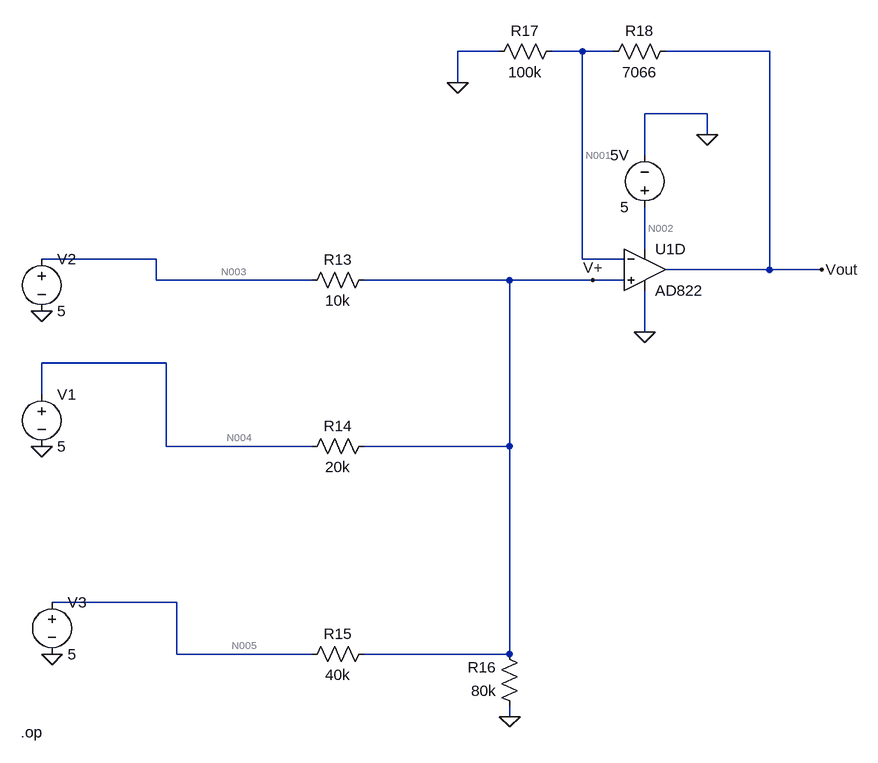
[diagram p0: schematic APP3 LTspice.asc]
APP3 LTspice.asc, the LTspice schematic file:
Version 4
SHEET 1 1444 680
WIRE 464 -464 400 -464
WIRE 592 -464 544 -464
WIRE 640 -464 592 -464
WIRE 880 -464 720 -464
WIRE 400 -416 400 -464
WIRE 784 -368 688 -368
WIRE 784 -336 784 -368
WIRE 688 -304 688 -368
WIRE 688 -160 688 -224
WIRE -64 -144 -240 -144
WIRE 592 -144 592 -464
WIRE 656 -144 592 -144
WIRE 880 -128 880 -464
WIRE 880 -128 720 -128
WIRE 960 -128 880 -128
WIRE -64 -112 -64 -144
WIRE 176 -112 -64 -112
WIRE 480 -112 256 -112
WIRE 608 -112 480 -112
WIRE 656 -112 608 -112
WIRE 688 -32 688 -96
WIRE -48 16 -240 16
WIRE -240 64 -240 16
WIRE -48 144 -48 16
WIRE 176 144 -48 144
WIRE 480 144 480 -112
WIRE 480 144 256 144
WIRE -32 384 -224 384
WIRE -32 464 -32 384
WIRE 176 464 -32 464
WIRE 480 464 480 144
WIRE 480 464 256 464
WIRE 480 560 480 544
FLAG 480 560 0
FLAG 400 -416 0
FLAG 688 -32 0
FLAG 784 -336 0
FLAG -240 -64 0
FLAG -240 144 0
FLAG -224 464 0
FLAG 960 -128 Vout
FLAG 608 -112 V+
DATAFLAG 496 -112 ""
DATAFLAG 864 -128 ""
SYMBOL res 160 -96 R270
WINDOW 0 32 56 VTop 2
WINDOW 3 0 56 VBottom 2
SYMATTR InstName R13
SYMATTR Value 10k
SYMBOL res 272 128 R90
WINDOW 0 0 56 VBottom 2
WINDOW 3 32 56 VTop 2
SYMATTR InstName R14
SYMATTR Value 20k
SYMBOL res 272 448 R90
WINDOW 0 0 56 VBottom 2
WINDOW 3 32 56 VTop 2
SYMATTR InstName R15
SYMATTR Value 40k
SYMBOL res 496 560 R180
WINDOW 0 36 76 Left 2
WINDOW 3 36 40 Left 2
SYMATTR InstName R16
SYMATTR Value 80k
SYMBOL voltage 688 -208 R180
WINDOW 0 24 96 Left 2
WINDOW 3 24 16 Left 2
SYMATTR InstName 5V
SYMATTR Value 5
SYMBOL OpAmps\\AD822 688 -192 R0
SYMATTR InstName U1D
SYMBOL res 560 -480 R90
WINDOW 0 0 56 VBottom 2
WINDOW 3 32 56 VTop 2
SYMATTR InstName R17
SYMATTR Value 100k
SYMBOL res 736 -480 R90
WINDOW 0 0 56 VBottom 2
WINDOW 3 32 56 VTop 2
SYMATTR InstName R18
SYMATTR Value 7066
SYMBOL voltage -240 48 R0
SYMATTR InstName V1
SYMATTR Value 5
SYMBOL voltage -240 -160 R0
WINDOW 123 0 0 Left 0
WINDOW 39 0 0 Left 0
SYMATTR InstName V2
SYMATTR Value 5
SYMBOL voltage -224 368 R0
WINDOW 123 0 0 Left 0
WINDOW 39 0 0 Left 0
SYMATTR InstName V3
SYMATTR Value 5
TEXT -272 584 Left 2 !.op

The netlist it stands for:
* APP3 LTspice.asc
R13 N003 V+ 10k
R14 V+ N004 20k
R15 V+ N005 40k
R16 0 V+ 80k
V§5V N002 0 5
XU1D V+ N001 N002 0 Vout AD822  ; pins In+ In- V+ V- OUT
R17 N001 0 100k
R18 Vout N001 7066
V1 N004 0 5
V2 N003 0 5
V3 N005 0 5
.op
.backanno
.end

* Results of the author's LTspice run, read from the files saved beside the schematic
* Operating Point:
*   V(n003) = 5 V
*   V(v+) = 4.667 V
*   V(n004) = 5 V
*   V(n005) = 5 V
*   V(n002) = 5 V
*   V(n001) = 4.664 V
*   V(vout) = 4.993 V
*   I(R18) = 46.64 µA
*   I(R17) = 46.64 µA
*   I(R16) = -58.33 µA
*   I(R15) = -8.333 µA
*   I(R14) = -16.67 µA
*   I(R13) = 33.33 µA
*   I(V3) = -8.333 µA
*   I(V2) = -33.33 µA
*   I(V1) = -16.67 µA
*   I(5v) = -708.9 µA
*   Ix(u1d:1) = 2.109 pA
*   Ix(u1d:2) = 2.108 pA
*   Ix(u1d:3) = 708.9 µA
*   Ix(u1d:4) = -662.3 µA
*   Ix(u1d:5) = -46.64 µA
* From the log:
*   Semiconductor Device Operating Points:
*                           --- Diodes ---
*   Name:    d:u1d:3     d:u1d:2     d:u1d:1     d:u1d:6     d:u1d:5
*   Model:  u1d:45ma    u1d:20ohm    u1d:iq      u1d:x2      u1d:x1
*   Id:     -4.66e-05    4.66e-05    6.60e-04   -2.50e-06   -2.44e-09
*   Vd:     -4.66e-04    1.24e-03    5.00e+00   -5.00e+00   -4.88e-03
*   Req:     1.00e-01    1.00e-01    5.00e-04    5.00e-07    5.00e-07
*   CAP:     0.00e+00    0.00e+00    0.00e+00    0.00e+00    0.00e+00
*   Name:   d:u1d:22    d:u1d:21
*   Model:   u1d:esd     u1d:esd
*   Id:     -2.50e-12   -2.51e-12
*   Vd:     -2.50e+00   -2.50e+00
*   Req:     1.00e-12    1.00e-12
*   CAP:     0.00e+00    0.00e+00